# EAGLE schematic CarrinhoAcel (EAGLE 9.0.0)
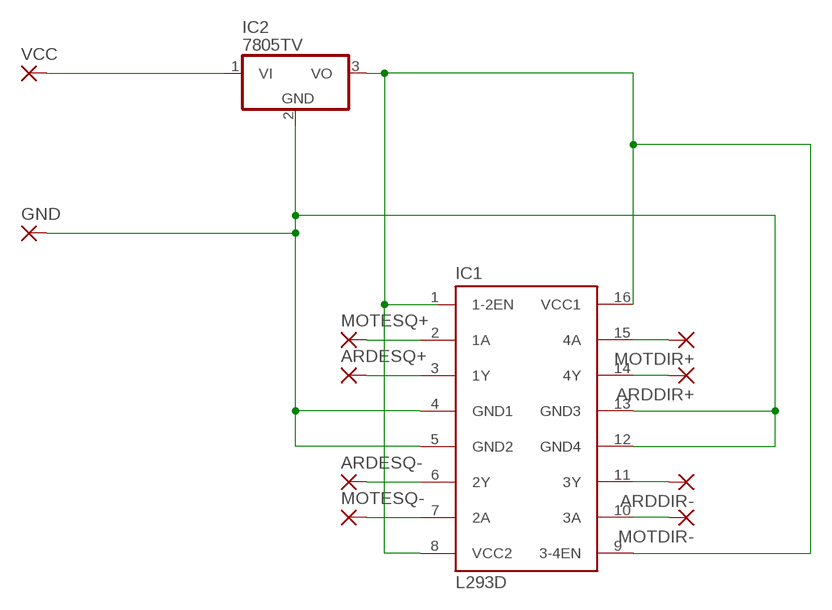
[diagram p0: schematic, sheet 1]

## Parts
ARDDIR+  2,15/1,0  [2,15/1,0]
ARDDIR-  2,15/1,0  [2,15/1,0]
ARDESQ+  2,15/1,0  [2,15/1,0]
ARDESQ-  2,15/1,0  [2,15/1,0]
GND  2,15/1,0  [2,15/1,0]
IC1  L293D  [DIL16]
IC2  7805TV  [TO220V]
MOTDIR+  2,15/1,0  [2,15/1,0]
MOTDIR-  2,15/1,0  [2,15/1,0]
MOTESQ+  2,15/1,0  [2,15/1,0]
MOTESQ-  2,15/1,0  [2,15/1,0]
VCC  2,15/1,0  [2,15/1,0]

## Nets
N$1: IC2.1(VI) VCC.1(P)
N$2: GND.1(P) IC1.4(GND1) IC1.5(GND2) IC1.12(GND4) IC1.13(GND3) IC2.2(GND)
N$3: IC1.2(1A) MOTESQ+.1(P)
N$4: ARDESQ+.1(P) IC1.3(1Y)
N$5: ARDESQ-.1(P) IC1.6(2Y)
N$6: IC1.7(2A) MOTESQ-.1(P)
N$7: IC1.8(VCC2) IC1.9(3-4EN) IC1.16(VCC1) IC2.3(VO)
N$8: IC1.10(3A) MOTDIR-.1(P)
N$9: ARDDIR-.1(P) IC1.11(3Y)
N$10: ARDDIR+.1(P) IC1.14(4Y)
N$11: IC1.15(4A) MOTDIR+.1(P)
Unconnected: IC1.1(1-2EN)

## Library data of the parts
ARDDIR+ ARDDIR- ARDESQ+ ARDESQ- GND MOTDIR+ MOTDIR- MOTESQ+ MOTESQ- VCC = wirepad:2,15/1,0: THROUGH-HOLE PAD
IC1 = st-microelectronics:L293D: PUSH-PULL 4 CHANNEL DRIVER; MPN: L293D; OC_FARNELL: 9589619; OC_NEWARK: 56P8249
IC2 = linear:78*: Positive VOLTAGE REGULATOR Source: http://cache.national.com/ds/LM/LM78L05.pdf http://www.fairchildsemi.com/ds/LM/LM7805.pdf